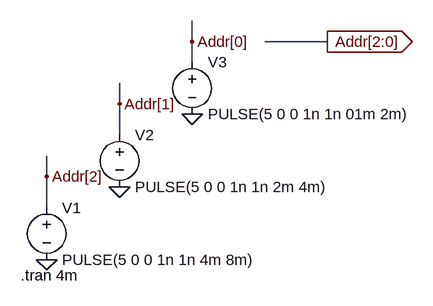
[diagram p0: schematic PC.asc]
PC.asc, the LTspice schematic file:
Version 4.1.1
SHEET 1 880 680
WIRE 128 -48 128 -80
WIRE 336 -48 240 -48
WIRE 128 -16 128 -48
WIRE 16 48 16 16
WIRE 16 96 16 48
WIRE -96 160 -96 128
WIRE -96 208 -96 160
FLAG 128 64 0
FLAG 16 176 0
FLAG -96 288 0
FLAG 128 -48 Addr[0]
FLAG 16 48 Addr[1]
FLAG -96 160 Addr[2]
FLAG 336 -48 Addr[2:0]
IOPIN 336 -48 Out
SYMBOL voltage -96 192 R0
SYMATTR InstName V1
SYMATTR Value PULSE(5 0 0 1n 1n 4m 8m)
SYMBOL voltage 16 80 R0
SYMATTR InstName V2
SYMATTR Value PULSE(5 0 0 1n 1n 2m 4m)
SYMBOL voltage 128 -32 R0
WINDOW 123 0 0 Left 0
WINDOW 39 0 0 Left 0
SYMATTR InstName V3
SYMATTR Value PULSE(5 0 0 1n 1n 01m 2m)
TEXT -136 312 Left 2 !.tran 4m

The netlist it stands for:
* PC.asc
V1 Addr[2] 0 PULSE(5 0 0 1n 1n 4m 8m)
V2 Addr[1] 0 PULSE(5 0 0 1n 1n 2m 4m)
V3 Addr[0] 0 PULSE(5 0 0 1n 1n 01m 2m)
.tran 4m
.backanno
.end